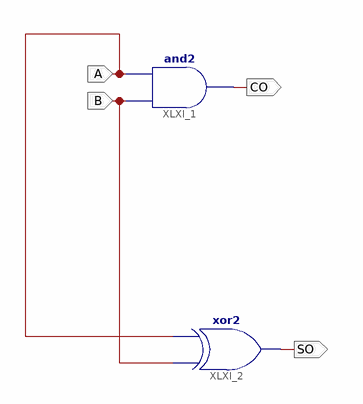
[diagram p0: schematic sheet 1]
// Xilinx ISE schematic Half_Add.sch (virtex4) as structural Verilog: 2 symbols, 4 ports
module Half_Add (
  input  A,
  input  B,
  output SO,
  output CO
);

  and XLXI_1 (CO, B, A);
  xor XLXI_2 (SO, B, A);
endmodule
